# Altium project Xenon_flash.PrjPcb
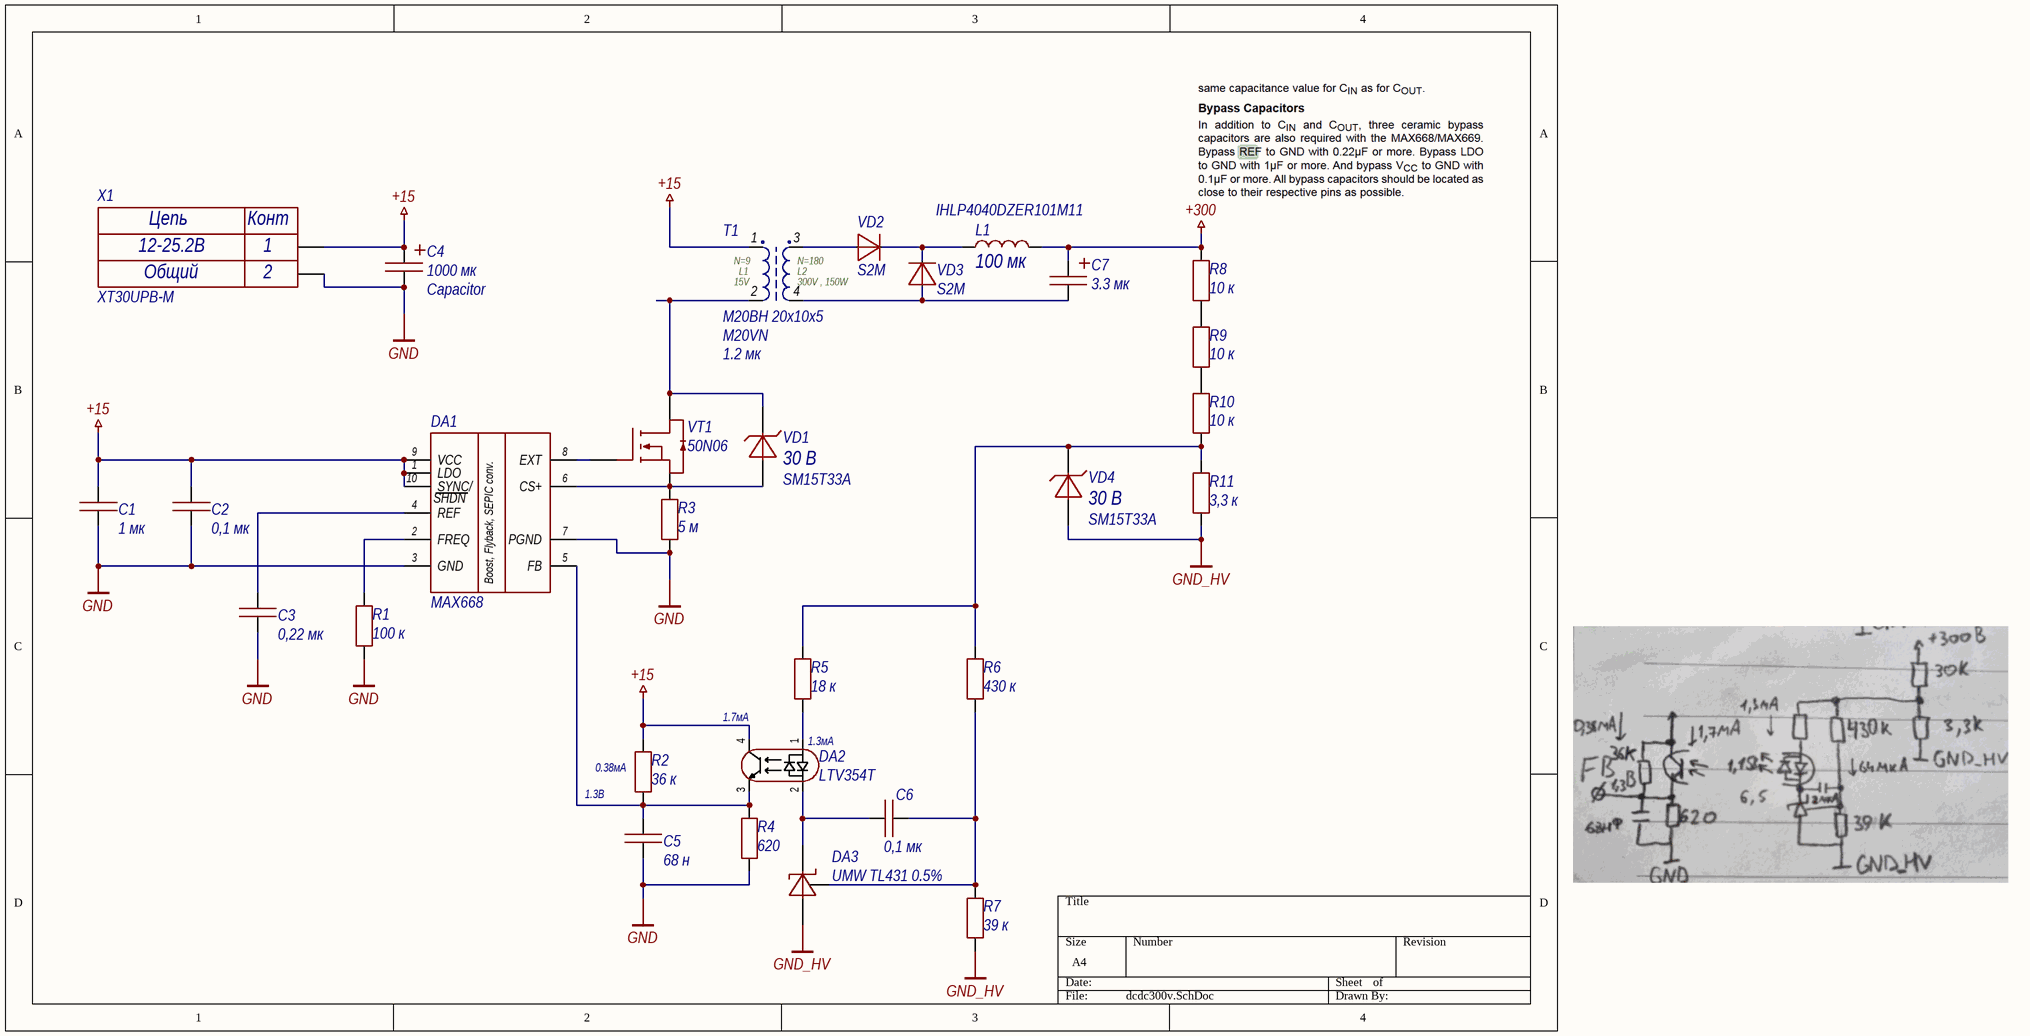
[diagram p0: dcdc300v.SchDoc]
Decimal_Number_PCB: ГИДР.123456.002; Decimal_Number_Shematic: ГИДР.123456.001; DrawnBy: Карманов С.; Release_Date: 31.05.25; Title: Преобразователь из 15В в 300В; Title1: Преобразователь из; Title2: 15В в 300В; Version: 01
1 sheet, 29 parts. Net scope: global (net labels, ports and power ports of the same name join across sheets).
Board file: vspyshka.PcbDoc

## Sheet dcdc300v.SchDoc: Преобразователь из 15В в 300В
size A4; SheetNumber: 1; SheetTotal: 1

### Parts
C1  value 1 мк  [0603C]  (hidden comment: Capacitor)
C2  value 0,1 мк  [0603C]  (hidden comment: Capacitor)
C3  value 0,22 мк  [0603C]  (hidden comment: Capacitor)
C4  Capacitor  value 1000 мк  [CAP_EEVFK1V102M]
C5  value 68 н  [0603C]  (hidden comment: Capacitor)
C6  value 0,1 мк  [0603C]  (hidden comment: Capacitor)
C7  value 3.3 мк  [8x12_radial]  (hidden comment: Capacitor)
DA1  MAX668  [uSOP10]
DA2  LTV354T  [SOP4-2_54]
DA3  UMW TL431 0.5%  [SOT23-3]
L1  IHLP4040DZER101M11  value 100 мк  [IHLP-4040]
R1  value 100 к  [0603R]  (hidden comment: Resistor)
R2  value 36 к  [0603R]  (hidden comment: Resistor)
R3  value 5 м  [2512R]  (hidden comment: Resistor)
R4  value 620  [0603R]  (hidden comment: Resistor)
R5  value 18 к  [0603R]  (hidden comment: Resistor)
R6  value 430 к  [0603R]  (hidden comment: Resistor)
R7  value 39 к  [0603R]  (hidden comment: Resistor)
R8  value 10 к  [0603R]  (hidden comment: Resistor)
R9  value 10 к  [0603R]  (hidden comment: Resistor)
R10  value 10 к  [0603R]  (hidden comment: Resistor)
R11  value 3,3 к  [0603R]  (hidden comment: Resistor)
T1  M20VN  value 1.2 мк  [M20VN]
VD1  SM15T33A  value 30 В  [SMC]
VD2  S2M  [SMB]
VD3  S2M  [SMB]
VD4  SM15T33A  value 30 В  [SMC]
VT1  50N06  [DPAK]
X1  XT30UPB-M  Value2: Общий  Value1: 12-25.2В  [XT30UPB-M]

### Nets
+15: C1.2 C2.2 C4.1 DA1.1(LDO) DA1.9(VCC) DA1.10(SYNC/) DA2.4(CT) R2.2 T1.1 X1.P
+300: C7.1 L1.2 R8.2
GND: C1.1 C2.1 C3.1 C4.2 C5.1 DA1.3(GND) DA1.7(PGND) R1.1 R3.1 R4.1 X1.N
GND_HV: DA3.3 R7.1 R11.1 VD4.1
NetC3_2: C3.2 DA1.4(REF)
NetC5_2: C5.2 DA1.5(FB) DA2.3(ET) R2.1 R4.2
NetC6_1: C6.1 DA2.2(C) DA3.2
NetC6_2: C6.2 DA3.1 R6.2 R7.2
NetC7_2: C7.2 T1.4 VD3.1
NetDA1_2: DA1.2(FREQ) R1.2
NetDA1_6: DA1.6(CS+) R3.2 VD1.1
NetDA1_8: DA1.8(EXT) VT1.1
NetDA2_1: DA2.1(A) R5.1
NetL1_1: L1.1 VD2.2 VD3.2
NetR5_2: R5.2 R6.1 R10.1 R11.2 VD4.2
NetR8_1: R8.1 R9.2
NetR9_1: R9.1 R10.2
NetT1_2: T1.2 VD1.2 VT1.2
NetT1_3: T1.3 VD2.1

Not connected (* = marked no-connect by the designer): VT1 3

### Notes on the sheet
- (near DA2) 1.7мA
- (near R2) 0.38мА
- (near DA2) 1.3мA
- 1.3В
- (in symbol M20VN) N=9; N=180; L1; L2; 15V; 300V , 150W; М20ВН 20х10х5
- (in symbol MAX668) SHDN; Boost, Flyback, SEPIC conv.
- (in symbol XT30UPB-M) Цепь; Конт; 1; 2

### Library data of the parts
C1 = Capacitor_1u_10_50V_X7R_0603C: Конденсатор; Library Path2: Schematic\Capacitor.SchLib; Tolerance: 0,1; Voltage (V): 50; Dielectric: X7R; Capacity (nF): 1000; Part Number: Capacitor_1u_10_50V_X7R_0603C
C2 C6 = Capacitor_0,1u_10_50V_X7R_0603C: Конденсатор; Library Path2: Schematic\Capacitor.SchLib; Tolerance: 0,1; Voltage (V): 50; Dielectric: X7R; Capacity (nF): 100; Part Number: Capacitor_0,1u_10_50V_X7R_0603C
C3 = Capacitor_0,22u_10_50V_X7R_0603C: Конденсатор; Library Path2: Schematic\Capacitor.SchLib; Tolerance: 0,1; Voltage (V): 50; Dielectric: X7R; Capacity (nF): 220; Part Number: Capacitor_0,22u_10_50V_X7R_0603C
C4 = EEVFK1V102M: Конденсатор алюминиевый электролитический 1000мкФ 25В 20% Low ESR 1100мА SMD12.5x13.5мм; Tolerance: 20; Voltage (V): 35; Type: SMD Aluminum; Capacity (uF): 1000; Part Number: EEVFK1V102M
C5 = Capacitor_68n_10_50V_X7R_0603C: Конденсатор; Library Path2: Schematic\Capacitor.SchLib; Tolerance: 0,1; Voltage (V): 50; Dielectric: X7R; Capacity (nF): 68; Part Number: Capacitor_68n_10_50V_X7R_0603C
C7 = JRB2G3R3M03500800120000B: К50-35, 3.3мкФ, 400В, 105°C, 20%, 8x12мм P:3.5мм; Tolerance: 20; Voltage (V): 400; Type: Aluminum; Capacity (uF): 3,3; Part Number: JRB2G3R3M03500800120000B
DA1 = MAX668: Boost, Flyback, SEPIC преобразователь. 10-uMAX/uSOP; MP: MAX668EUB+T; MF: Maxim Integrated; Purchase-URL: https://pricing.snapeda.com/search/part/MAX668EUB+T/?ref=eda; Package: MICROMAX-10 Maxim; Value: *; Price: None; Availability: In Stock; SnapEDA_Link: https://www.snapeda.com/parts/MAX668EUB+T/Maxim+Integrated/view-part/?ref=snap; Check_prices: https://www.snapeda.com/parts/MAX668EUB+T/Maxim+Integrated/view-part/?ref=eda; Part Number: MAX668
DA2 = LTV354T: Оптопара с транзисторным выходом, UMW; SnapEDA_Link: https://www.snapeda.com/parts/LTV816/Lite-On/view-part/?ref=snap; Check_prices: https://www.snapeda.com/parts/LTV816/Lite-On/view-part/?ref=eda; Value: *; Part Number: LTV354T
DA3 = UMW TL431 0.5%: Источник опорного напряжения , программируемый стабилитрон [SOT-23-3]; Part Number: UMW TL431 0.5%
L1 = IHLP4040DZER101M11: ЧИП-индуктивность экранированная 47мкГн ±20% 3,3A 145мОм 4040; Inductance (μH): 100; Current (A): 3,3; Part Number: IHLP4040DZER101M11
R1 = Resistor_100k_1_0603: Резистор номиналом 100 кОм и точностью 1%; Power: *; Part Number: Resistor_100k_1_0603; Tolerance: 1%
R2 = Resistor_36k_1_0603: Резистор номиналом 36 кОм и точностью 1%; Power: *; Part Number: Resistor_36k_1_0603; Tolerance: 1%
R3 = CRE2512-FZ-R005E-3: Резистор номиналом 5 мОм, точностью 1%, 3Вт; Power: *; Part Number: CRE2512-FZ-R005E-3; Tolerance: 1%
R4 = Resistor_620_1_0603: Резистор номиналом 620 Ом и точностью 1%; Power: *; Part Number: Resistor_620_1_0603; Tolerance: 1%
R5 = Resistor_18k_1_0603: Резистор номиналом 18 кОм и точностью 1%; Power: *; Part Number: Resistor_18k_1_0603; Tolerance: 1%
R6 = Resistor_430k_1_0603: Резистор номиналом 430 кОм и точностью 1%; Power: *; Part Number: Resistor_430k_1_0603; Tolerance: 1%
R7 = Resistor_39k_1_0603: Резистор номиналом 39 кОм и точностью 1%; Power: *; Part Number: Resistor_39k_1_0603; Tolerance: 1%
R8-R10 = Resistor_10k_1_0603: Резистор номиналом 10 кОм и точностью 1%; Power: *; Part Number: Resistor_10k_1_0603; Tolerance: 1%
R11 = Resistor_3.3k_1_0603: Резистор номиналом 3,3 кОм и точностью 1%; Power: *; Part Number: Resistor_3.3k_1_0603; Tolerance: 1%
T1 = M20VN: Накопительная индуктивность для обратноходового преобразователя, L1=1.2uH, магнитопровод М20ВН, 20х10х5, первичная обмотка d1.3мм; Input Voltage (AC): 15; Turns Ratio: "20","1:2"; Output Voltage (DC): 300; Output Current (A): 0.5; Inductance: 0.9mH; Inductance (μH): 1,2; Part Number: M20VN; Current (A): 15
VD1 VD4 = SM15T33A: Защитный диод на 30 В, рассеиваемая мощность 1500 Вт; Voltage nominal (V): 30; Power (W): 1500; Part Number: SM15T33A
VD2 VD3 = S2M: Выпрямительный диод на 1000 В, ном. ток 2 А; Repetitive peak reverse voltage (Vrrm): 1000; Current (A): 2; Part Number: S2M
VT1 = 50N06: N-канальный MOSFET; Напряжение С-И/К-Э: 60 В; Ток макс#: 50 А; Part Number: 50N06
X1 = XT30UPB-M: 2-пиновый разъем с ключом; Part Number: XT30UPB-M

## Assembly variants
01: all parts fitted